# Altium schematic sheet Emergency Thermal Shutdown.SchDoc: Emergency Thermal Shutdown
size A4; Date: 2017-08-06; Revision: A; DesignedBy: Craig Comberbach
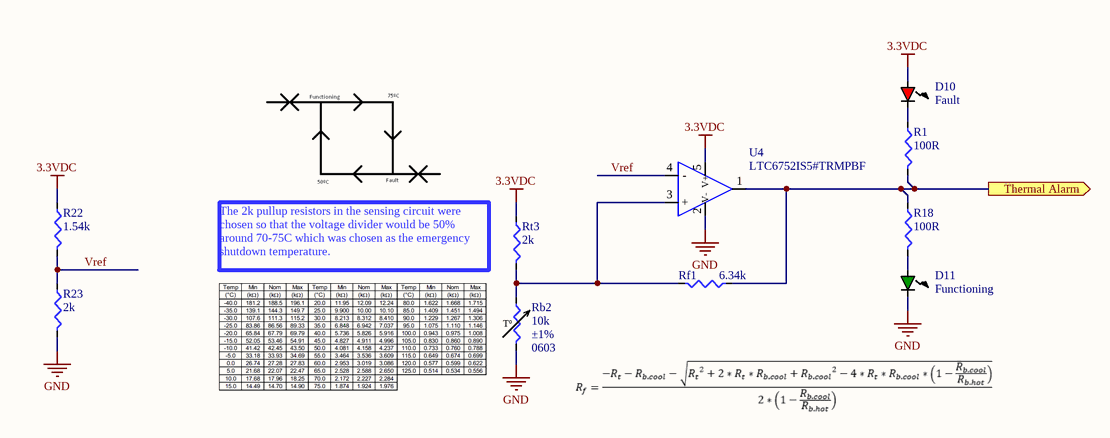
[diagram p0: Emergency Thermal Shutdown.SchDoc]

## Parts
D10  Fault  [LED - 1206 Red]
D11  Functioning  [LED - 1206 Green]
R1  Resistance (Ohms): 100R  [R0603]  (hidden comment: 100R 0603 1%)
R18  Resistance (Ohms): 100R  [R0603]  (hidden comment: 100R 0603 1%)
R22  Resistance: 1.54k  [R0603]  (hidden comment: 1.54k 0603 1%)
R23  Resistance (Ohms): 2k  [R0603]  (hidden comment: 2k 0603 1%)
Rb2  Resistance in Ohms @ 25°C: 10k  Resistance Tolerance: ±1%  Package / Case: 0603  (hidden comment: Thermistor 10k Type J SMT)  (mechanical)
Rf1  Resistance: 6.34k  [R0603]  (hidden comment: 6.34k 0603 1%)
Rt3  Resistance (Ohms): 2k  [R0603]  (hidden comment: 2k 0603 1%)
U4  Manufacturer Part Number: LTC6752IS5#TRMPBF  (hidden comment: Single Comparator LTC6752)

## Ports
Thermal Alarm (out)

## Nets
3.3VDC: D10.1 R22.2 Rt3.2 U4.5(V+)
GND: D11.2 R23.1 Rb2.2 U4.2(V-)
Thermal Alarm: R1.1 R18.2 Rf1.2 U4.1(Out) ; port Thermal Alarm
Vref: R22.1 R23.2 U4.4(-)
NetD10_2: D10.2 R1.2
NetD11_1: D11.1 R18.1
NetRb2_1: Rb2.1 Rf1.1 Rt3.1 U4.3(+)

## Notes on the sheet
- The 2k pullup resistors in the sensing circuit were chosen so that the voltage divider would be 50% around 70-75C which was chosen as the emergency shutdown temperature.
- Repository Version
- BOM/Variant
- (in symbol Thermistor 10k Type J SMT) Tº

## Library data of the parts
D10 = Red LED 1206: Manufacturer: Kingbright; Manufacturer Part Number: APT3216SRCPRV; Color: Red; Wavelength - Dominant: 640nm; Wavelength - Peak: 660nm; Millicandela Rating: 80mcd; Voltage - Forward (Vf) (Typ): 1.85V; Current - Test: 20mA; Viewing Angle: 120°; Lens Type: Clear; Lens Style/Size: Rectangle with Flat Top, 2mm x 1.6mm; Value: Red LED 1206; Supplier 1: Digi-Key; RoHS: RoHS Compliant; Category: Optoelectronics; Stock 1: 29504; Pricing 1: 1=0.2, 10=0.149, 25=0.1188, 100=0.1073, 250=0.099, 500=0.0891 (USD); Packaging: Cut Tape (CT); Package / Case: 1206 (3216 Metric); Size / Dimension: 3.20mm L x 1.60mm W; Height: 0.75mm; Mounting Type: Surface Mount; Luminous Flux @ Current - Test: -; ComponentLink1URL: http://www.kingbrightusa.com/images/catalog/SPEC/APT3216SRCPRV.pdf; ComponentLink1Description: Spec Sheet; Supplier Part Number 1: 754-1142-1-ND
D11 = Green LED 1206: Manufacturer: Kingbright; Manufacturer Part Number: APL3015SGC-F01; Color: Green; Wavelength - Dominant: 568nm; Wavelength - Peak: 565nm; Millicandela Rating: 20mcd; Voltage - Forward (Vf) (Typ): 2.2V; Current - Test: 20mA; Viewing Angle: 70°; Lens Type: Clear; Lens Style/Size: Rectangle with Flat Top, 2mm x 1.6mm; Value: Green LED 1206; Supplier 1: Digi-Key; Supplier Part Number 1: 754-1111-1-ND; RoHS: RoHS Compliant; Category: Optoelectronics; Stock 1: 31522; Pricing 1: 1=0.21, 10=0.156, 25=0.1248, 100=0.1127, 250=0.104, 500=0.09362 (CAD); Packaging: Cut Tape (CT); Package / Case: 2-SMD, No Lead; Size / Dimension: 3.00mm L x 1.50mm W; Height: 1.40mm; Mounting Type: Surface Mount; Luminous Flux @ Current - Test: -; ComponentLink1URL: http://www.kingbrightusa.com/images/catalog/SPEC/APL3015SGC-F01.pdf; ComponentLink1Description: Spec Sheet
R1 R18 = 100R 0603 1%: 1/8W; Manufacturer: Yageo; Manufacturer Part Number: RC0603FR-07100RL; Power (Watts): 0.1W, 1/10W; Temperature Coefficient: ±100ppm/°C; Value: 100R 0603 1%; Supplier 1: Digi-Key; RoHS: RoHS Compliant; Category: Resistors; Stock 1: 2116183; Pricing 1: 1=0.1, 10=0.015, 25=0.0108, 100=0.006, 250=0.00456, 500=0.00364, 1000=0.00268, 2500=0.00233 (USD); Packaging: Cut Tape (CT); Tolerance: ±1%; Composition: Thick Film; Features: Moisture Resistant; Operating Temperature: -55°C ~ 155°C; Package / Case: 0603 (1608 Metric); Supplier Device Package: 0603; Size / Dimension: 0.063" L x 0.031" W (1.60mm x 0.80mm); Height: 0.022" (0.55mm); Number of Terminations: 2; ComponentLink1URL: http://www.yageo.com/NewPortal/yageodocoutput?fileName=/pdf/R-Chip/PYu-RC_Group_51_RoHS_L_0.pdf; ComponentLink1Description: http://www.yageo.com/NewPortal/yageodocoutput?fileName=/pdf/R-Chip/PYu-RC_Group_51_RoHS_L_0.pdf; Supplier Part Number 1: 311-100HRCT-ND
R22 = 1.54k 0603 1%: Manufacturer: Yageo; Manufacturer Part Number: RC0603FR-071K54L; Power (Watts): 0.1W, 1/10W; Temperature Coefficient: ±100ppm/°C; Value: 1.54k 0603 1%; Supplier 1: Digi-Key; RoHS: RoHS Compliant; Category: Resistors; Stock 1: 163691; Pricing 1: 1=0.1, 10=0.015, 100=0.006, 1000=0.00268, 2500=0.00233 (USD); Packaging: Cut Tape (CT); Tolerance: ±1%; Composition: Thick Film; Features: Moisture Resistant; Operating Temperature: -55°C ~ 155°C; Package / Case: 0603 (1608 Metric); Supplier Device Package: 0603; Size / Dimension: 0.063" L x 0.031" W (1.60mm x 0.80mm); ComponentLink1URL: http://www.yageo.com/documents/recent/PYu-RC_Group_51_RoHS_L_7.pdf; ComponentLink1Description: Spec Sheet; Supplier Part Number 1: 311-1.54KHRCT-ND; Part Status: Active; Height - Seated (Max): 0.022" (0.55mm); Failure Rate: -
R23 Rt3 = 2k 0603 1%: Manufacturer: Panasonic Electronic Components; Manufacturer Part Number: ERJ-3EKF2001V; Power (Watts): 0.1W, 1/10W; Temperature Coefficient: ±100ppm/°C; Value: 2k 0603 1%; Supplier 1: Digi-Key; RoHS: RoHS Compliant; Category: Resistors; Stock 1: 1444697; Pricing 1: 1=0.1, 50=0.0114, 100=0.0084, 250=0.00644, 500=0.00514, 1000=0.00379 (USD); Packaging: Cut Tape (CT); Tolerance: ±1%; Composition: Thick Film; Features: Automotive AEC-Q200; Operating Temperature: -55°C ~ 155°C; Package / Case: 0603 (1608 Metric); Supplier Device Package: 0603; Size / Dimension: 0.063" L x 0.031" W (1.60mm x 0.80mm); Height: 0.022" (0.55mm); Number of Terminations: 2; ComponentLink1URL: http://industrial.panasonic.com/www-cgi/jvcr13pz.cgi?E+PZ+3+AOA0002+ERJ3EKF2001V+7+WW; ComponentLink1Description: Spec Sheet; Supplier Part Number 1: P2.00KHCT-ND
Rb2 = Thermistor 10k Type J SMT: Resistor; Manufacturer: TDK Corporation; Manufacturer Part Number: NTCG163JF103FTDS; B25/50: 3380K; B25/85: 3435K; Value: Thermistor 10k Type J SMT; Supplier 1: Digi-Key; RoHS: RoHS Compliant; Category: Sensors, Transducers; Stock 1: 5895; Pricing 1: 1=0.3, 5=0.282, 10=0.251, 25=0.2312, 50=0.1848, 100=0.1584, 500=0.1386, 1000=0.1188 (USD); Packaging: Cut Tape (CT); Part Status: Active; B Value Tolerance: ±1%; B0/50: -; B25/75: -; B25/100: -; Operating Temperature: -40°C ~ 125°C; Power - Max: -; Length - Lead Wire: -; Mounting Type: Surface Mount; ComponentLink1URL: https://product.tdk.com/info/en/catalog/datasheets/tpd_automotive_ntc-thermistor_ntcg_en.pdf; ComponentLink1Description: Spec Sheet; Supplier Part Number 1: 445-174516-1-ND
Rf1 = 6.34k 0603 1%: Manufacturer: Yageo; Manufacturer Part Number: RC0603FR-076K34L; Power (Watts): 0.1W, 1/10W; Temperature Coefficient: ±100ppm/°C; Value: 6.34k 0603 1%; Supplier 1: Digi-Key; RoHS: RoHS Compliant; Category: Resistors; Stock 1: 245792; Pricing 1: 1=0.1, 10=0.015, 100=0.006, 1000=0.00268, 2500=0.00233 (USD); Packaging: Cut Tape (CT); Part Status: Active; Tolerance: ±1%; Composition: Thick Film; Features: Moisture Resistant; Operating Temperature: -55°C ~ 155°C; Package / Case: 0603 (1608 Metric); Supplier Device Package: 0603; Size / Dimension: 0.063" L x 0.031" W (1.60mm x 0.80mm); Height - Seated (Max): 0.022" (0.55mm); Failure Rate: -; ComponentLink1URL: http://www.yageo.com/documents/recent/PYu-RC_Group_51_RoHS_L_7.pdf; ComponentLink1Description: Spec Sheet; Supplier Part Number 1: 311-6.34KHRCT-ND
U4 = Single Comparator LTC6752: Manufacturer: Linear Technology; Output Type: CMOS; Voltage - Supply, Single/Dual (±): 2.45 V ~ 5.25 V; Voltage - Input Offset (Max): 5.5mV @ 5V; Current - Input Bias (Max): 1.6µA @ 5V; Current - Output (Typ): 19mA @ 5V; Current - Quiescent (Max): 2.65mA; Propagation Delay (Max): 5.3ns; Value: Comparator LTC6752; Supplier 1: Digi-Key; RoHS: RoHS Compliant; Category: Integrated Circuits (ICs); Stock 1: 612; Pricing 1: 1=4, 25=3.5676, 100=2.268, 250=2.079 (USD); Packaging: Cut Tape (CT); Part Status: Active; Type: General Purpose; CMRR, PSRR (Typ): -; Hysteresis: -; Operating Temperature: -40°C ~ 85°C; Package / Case: SOT-23-5 Thin, TSOT-23-5; Mounting Type: Surface Mount; Supplier Device Package: TSOT-23-5; ComponentLink1URL: http://www.linear.com/docs/45780; ComponentLink1Description: Spec Sheet; Supplier Part Number 1: LTC6752IS5#TRMPBFCT-ND